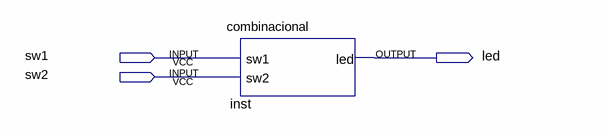
[diagram p0: schematic sheet]
// Quartus schematic parte_a.bdf as structural Verilog: 1 symbols, 3 pins
module parte_a (
  input  sw1,
  input  sw2,
  output led
);

  combinacional inst (.sw1(sw1), .sw2(sw2), .led(led));
endmodule
